# Altium schematic sheet Gas_sensors_top.SchDoc
size A4
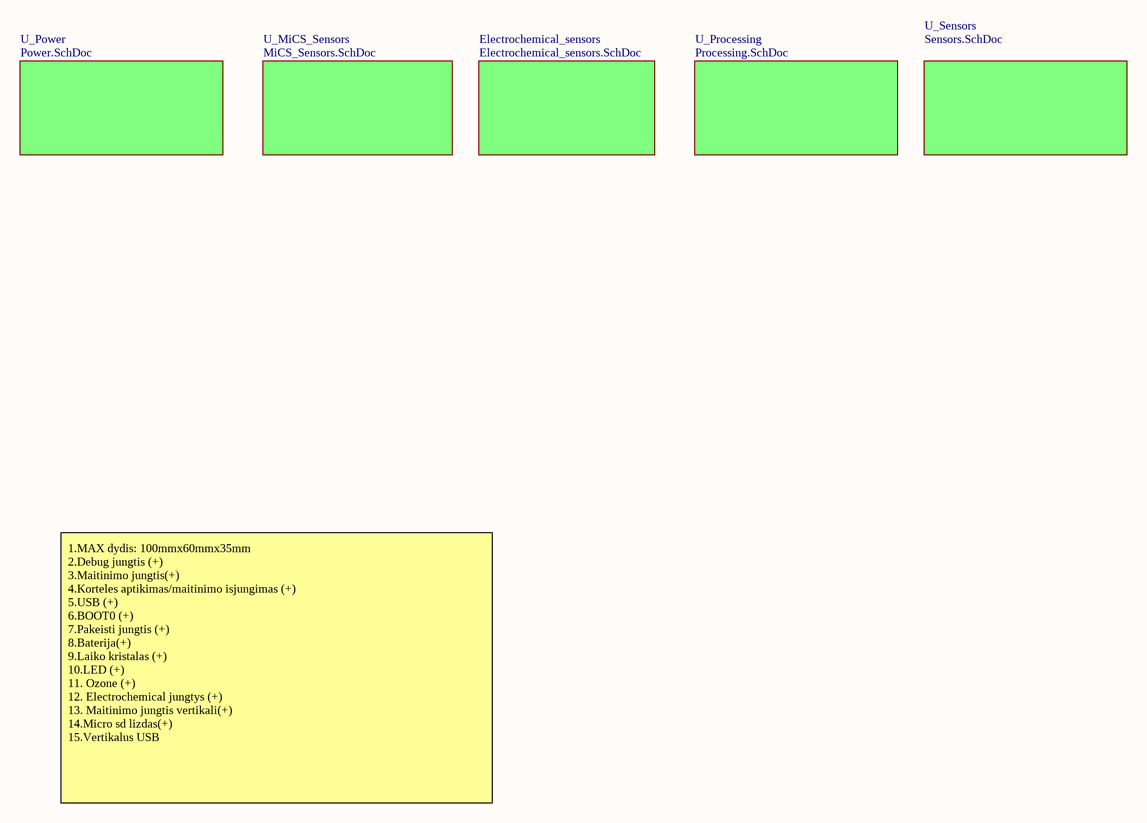
[diagram p0: Gas_sensors_top.SchDoc]

## Sub-sheets
Electrochemical_sensors = Electrochemical_sensors.SchDoc: no entries
U_MiCS_Sensors = MiCS_Sensors.SchDoc: no entries
U_Power = Power.SchDoc: no entries
U_Processing = Processing.SchDoc: no entries
U_Sensors = Sensors.SchDoc: no entries

## Notes on the sheet
- 1.MAX dydis: 100mmx60mmx35mm
  2.Debug jungtis (+)
  3.Maitinimo jungtis(+)
  4.Korteles aptikimas/maitinimo isjungimas (+)
  5.USB (+)
  6.BOOT0 (+)
  7.Pakeisti jungtis (+)
  8.Baterija(+)
  9.Laiko kristalas (+)
  10.LED (+)
  11. Ozone (+)
  12. Electrochemical jungtys (+)
  13. Maitinimo jungtis vertikali(+)
  14.Micro sd lizdas(+)
  15.Vertikalus USB